# EAGLE schematic pendulum (EAGLE 7.6.0)
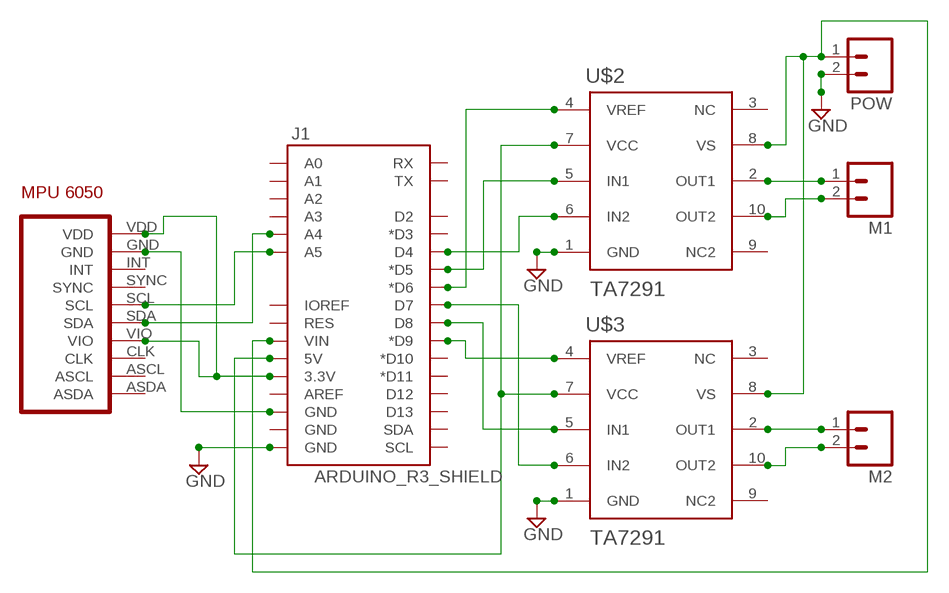
[diagram p0: schematic, sheet 1]

## Parts
J1  ARDUINO_R3_SHIELD  [UNO_R3_SHIELD]
M1  M02LOCK_LONGPADS  [1X02_LOCK_LONGPADS]
M2  M02LOCK_LONGPADS  [1X02_LOCK_LONGPADS]
POW  M02LOCK_LONGPADS  [1X02_LOCK_LONGPADS]
U$1  MPU6050  [MPU6050]
U$2  TA7291  [HSIP10]
U$3  TA7291  [HSIP10]

## Nets
GND: J1.GND@0(GND) POW.2 U$2.1(GND) U$3.1(GND)
N$1: J1.A4 U$1.SDA
N$2: J1.A5 U$1.SCL
N$3: J1.GND@2(GND) U$1.GND
N$4: M1.1 U$2.2(OUT1)
N$5: J1.3.3V U$1.VDD U$1.VIO
N$6: M1.2 U$2.10(OUT2)
N$7: M2.1 U$3.2(OUT1)
N$8: M2.2 U$3.10(OUT2)
N$9: J1.VIN POW.1 U$2.8(VS) U$3.8(VS)
N$10: J1.D6(*D6) U$2.4(VREF)
N$11: J1.D9(*D9) U$3.4(VREF)
N$12: J1.D5(*D5) U$2.5(IN1)
N$13: J1.D4 U$2.6(IN2)
N$14: J1.D8 U$3.5(IN1)
N$15: J1.D7 U$3.6(IN2)
N$17: J1.5V U$2.7(VCC) U$3.7(VCC)
Unconnected: J1.A0 J1.A1 J1.A2 J1.A3 J1.AREF J1.D2 J1.D3(*D3) J1.D10(*D10) J1.D11(*D11) J1.D12 J1.D13 J1.GND@1(GND) J1.IOREF J1.RES J1.RX J1.SCL J1.SDA J1.TX U$1.ASCL U$1.ASDA U$1.CLK U$1.INT U$1.SYNC U$2.3(NC) U$2.9(NC2) U$3.3(NC) U$3.9(NC2)

## Library data of the parts
J1 = SparkFun-Boards:ARDUINO_R3_SHIELD: Shield form compatible with the Arduino Uno R3.
M1 M2 POW = SparkFun-Connectors:M02: Standard 2-pin 0.1" header. Use with - straight break away headers ( PRT-00116) - right angle break away headers (PRT-00553) - swiss pins (PRT-00743) - machine pins (PRT-00117) - female headers (PRT-00115) Molex polarized connector foot print use with: PRT-08233 with associated crimp pins and housings. 2.54_SCREWTERM for use with PRT-10571. 3.5mm Screw Terminal footprints for PRT-08084 5mm Screw Terminal footprints for use with PRT-08432
U$1 = inv_pendulum:MPU6050
U$2 U$3 = TA7291P:TA7291